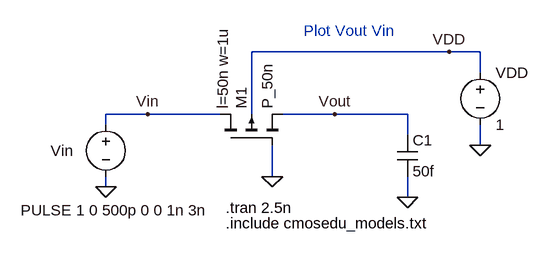
[diagram p0: schematic Fig10_19_PMOS.asc]
Fig10_19_PMOS.asc, the LTspice schematic file:
Version 4
SHEET 1 1136 680
WIRE 736 -208 432 -208
WIRE 784 -208 736 -208
WIRE 784 -176 784 -208
WIRE 272 -112 208 -112
WIRE 384 -112 272 -112
WIRE 432 -112 432 -208
WIRE 560 -112 480 -112
WIRE 672 -112 560 -112
WIRE 208 -96 208 -112
WIRE 672 -80 672 -112
WIRE 784 -64 784 -96
WIRE 464 -16 464 -64
WIRE 208 0 208 -16
WIRE 672 16 672 -16
FLAG 208 0 0
FLAG 672 16 0
FLAG 560 -112 Vout
FLAG 272 -112 Vin
FLAG 784 -64 0
FLAG 464 -16 0
FLAG 736 -208 VDD
SYMBOL voltage 208 -112 R0
WINDOW 0 -85 56 Left 0
WINDOW 3 -131 148 Left 0
WINDOW 123 0 0 Left 0
WINDOW 39 0 0 Left 0
SYMATTR InstName Vin
SYMATTR Value PULSE 1 0 500p 0 0 1n 3n
SYMBOL cap 656 -80 R0
SYMATTR InstName C1
SYMATTR Value 50f
SYMBOL voltage 784 -192 R0
WINDOW 123 0 0 Left 0
WINDOW 39 0 0 Left 0
SYMATTR InstName VDD
SYMATTR Value 1
SYMBOL pmos4 384 -64 R270
WINDOW 123 56 4 Left 0
SYMATTR Value2 l=50n w=1u
SYMATTR InstName M1
SYMATTR Value P_50n
TEXT 392 32 Left 0 !.tran 2.5n
TEXT 392 56 Left 0 !.include cmosedu_models.txt
TEXT 512 -240 Left 0 ;Plot Vout Vin

The netlist it stands for:
* Fig10_19_PMOS.asc
Vin Vin 0 PULSE 1 0 500p 0 0 1n 3n
C1 Vout 0 50f
VDD VDD 0 1
M1 Vin 0 Vout VDD P_50n l=50n w=1u
.model NMOS NMOS
.model PMOS PMOS
.lib standard.mos
.tran 2.5n
.include cmosedu_models.txt
* Plot Vout Vin
.backanno
.end